# Altium schematic sheet Zigbee interface.SchDoc
size A4; Organization: Altium Limited; Address1: 3 Minna Close; Address2: Belrose; Address3: NSW 2085; Address4: Australia
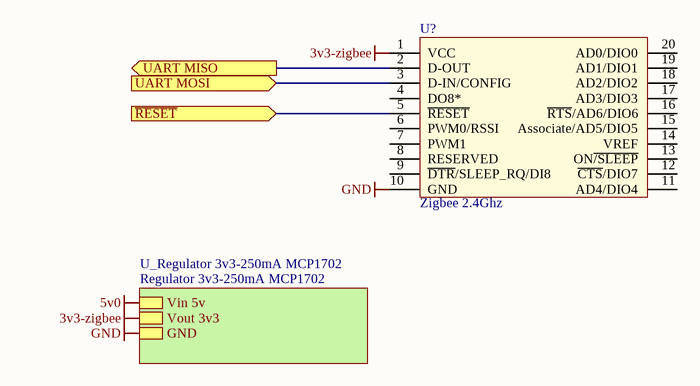
[diagram p0: Zigbee interface.SchDoc]

## Parts
U?  Zigbee 2.4Ghz  [Zigbee_maxstream]

## Sub-sheets
U_Regulator 3v3-250mA MCP1702 = Regulator 3v3-250mA MCP1702: Vin 5v, Vout 3v3, GND

## Ports
UART MISO (out), UART MOSI (in), ~{RESET} (in)

## Nets
3v3-zigbee: U?.1(VCC) ; sheet U_Regulator 3v3-250mA MCP1702/Vout 3v3
5v0: sheet U_Regulator 3v3-250mA MCP1702/Vin 5v
GND: U?.10(GND) ; sheet U_Regulator 3v3-250mA MCP1702/GND
~{RESET}: U?.5(~{RESET}) ; port ~{RESET}
UART MISO: U?.2(D-OUT) ; port UART MISO
UART MOSI: U?.3(D-IN/CONFIG) ; port UART MOSI

Not connected (* = marked no-connect by the designer): U? 4(DO8*) 6(PWM0/RSSI) 7(PWM1) 8(RESERVED) 9(~{DTR}/SLEEP_RQ/DI8) 11(AD4/DIO4) 12(~{CTS}/DIO7) 13(ON~{/SLEEP}) 14(VREF) 15(Associate/AD5/DIO5) 16(~{RTS}/AD6/DIO6) 17(AD3/DIO3) 18(AD2/DIO2) 19(AD1/DIO1) 20(AD0/DIO0)

## Notes on the sheet
- Title
- Size:
- Date:
- A4
- Name:
- Time:
- Ing. W. Pietersz
- Revision:
- Sheet
- of
- WillyPietersz@gmail.com
- Contact:
- info@unique-system.nl
- Unique System Elektronics
- Biesboschhaven noord 1-b
- 4251 NL Werkendam
- Netherlands
- www.unique-system.nl
- File:

## Library data of the parts
U? = Zigbee-WRL-08690: Wireless, zigbee module from Maxstream;; Part Number: Zigbee-WRL-08690; Component Type: Wireless, Zigbee; ComponentLink1Description: Datasheet; ComponentLink1URL: http://www.sparkfun.com/datasheets/Wireless/Zigbee/XBee-Datasheet.pdf